# EAGLE schematic M_B_adapter_414 (EAGLE 9.6.2)
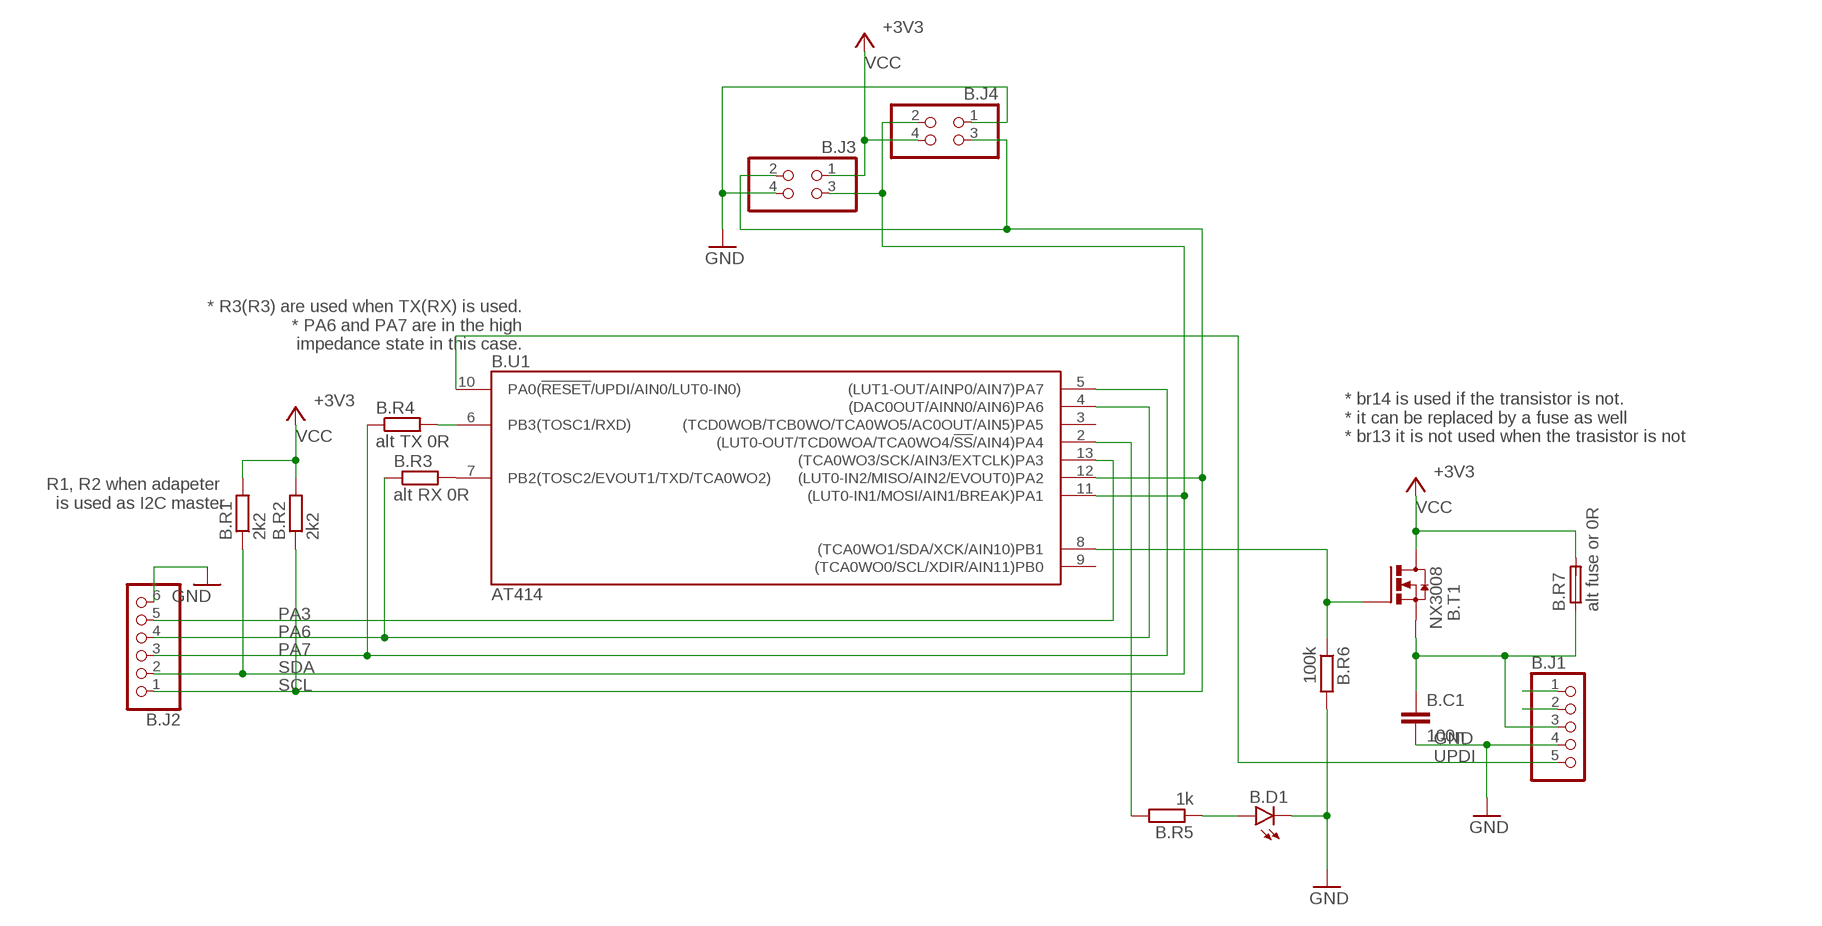
[diagram p0: schematic, sheet 1]

## Parts
B.C1  100n  C-EUC0603  [C0603]
B.D1  LEDCHIP-LED0603  [CHIP-LED0603]
B.J1  PINHD-1X5  [1X05]
B.J2  PINHD-1X6  [1X06]
B.J3  PINHD-2X2  [2X02]
B.J4  PINHD-2X2  [2X02]
B.R1  2k2  R-EU_R0603  [R0603]
B.R2  2k2  R-EU_R0603  [R0603]
B.R3  alt RX 0R  R-EU_R0603  [R0603]
B.R4  alt TX 0R  R-EU_R0603  [R0603]
B.R5  1k  R-EU_R0603  [R0603]
B.R6  100k  R-EU_R0603  [R0603]
B.R7  alt fuse or 0R  FUSE  [FUSE]
B.T1  NX3008  N-MOSFET  [SO23]
B.U1  AT414  ATTINY414-SSN  [SO14]

## Nets
GND: B.C1.2 B.D1.C1(C) B.J1.4 B.J2.6 B.J3.4 B.J4.1 B.R6.2
N$1: B.R4.2 B.U1.6(PB3(TOSC1/RXD))
N$2: B.R3.2 B.U1.7(PB2(TOSC2/EVOUT1/TXD/TCA0WO2))
N$3: B.R6.1 B.T1.G B.U1.8((TCA0WO1/SDA/XCK/AIN10)PB1)
N$4: B.C1.1 B.J1.3 B.R7.1 B.T1.S
N$5: B.R5.2 B.U1.2((LUT0-OUT/TCD0WOA/TCA0WO4/!SS!/AIN4)PA4)
PA1: B.D1.A1(A) B.R5.1
PA3: B.J2.5 B.U1.13((TCA0WO3/SCK/AIN3/EXTCLK)PA3)
PA6: B.J2.4 B.R3.1 B.U1.4((DAC0OUT/AINN0/AIN6)PA6)
PA7: B.J2.3 B.R4.1 B.U1.5((LUT1-OUT/AINP0/AIN7)PA7)
SCL: B.J2.1 B.J3.2 B.J4.3 B.R2.1 B.U1.12((LUT0-IN2/MISO/AIN2/EVOUT0)PA2)
SDA: B.J2.2 B.J3.3 B.J4.2 B.R1.1 B.U1.11((LUT0-IN1/MOSI/AIN1/BREAK)PA1)
UPDI: B.J1.5 B.U1.10(PA0(!RESET!/UPDI/AIN0/LUT0-IN0))
VBAT: B.J1.2
VCC: B.J3.1 B.J4.4 B.R1.2 B.R2.2 B.R7.2 B.T1.D ; supply symbol labelled +3V3
VUSB: B.J1.1
Unconnected: B.U1.3((TCD0WOB/TCB0WO/TCA0WO5/AC0OUT/AIN5)PA5) B.U1.9((TCA0WO0/SCL/XDIR/AIN11)PB0)

## Notes on the sheet
- * R3(R3) are used when TX(RX) is used. 
  * PA6 and PA7 are in the high 
    impedance state in this case.
- * br14 is used if the transistor is not. 
  * it can be replaced by a fuse as well
  * br13 it is not used when the trasistor is not
- R1, R2 when adapeter 
  is used as I2C master

## Power pins joined to a net without a drawn wire
GND: B.U1.14(GND)
VCC: B.U1.1(VCC)

## Library data of the parts
B.C1 = rcl:C-EU: CAPACITOR, European symbol; SPICEPREFIX: C
B.D1 = led:LED: LED OSRAM: - CHIPLED LG R971, LG N971, LY N971, LG Q971, LY Q971, LO R971, LY R971 LH N974, LH R974 LS Q976, LO Q976, LY Q976 LO Q996 - Hyper CHIPLED LW Q18S LB Q993, LB Q99A, LB R99A - SideLED LS A670, LO A670, LY A670, LG A670, LP A670 LB A673, LV A673, LT A673, LW A673 LH A674 LY A675 LS A676, LA A676, LO A676, LY A676, LW A676 LS A679, LY A679, LG A679 - Hyper Micro SIDELED® LS Y876, LA Y876, LO Y876, LY Y876 LT Y87S - SmartLED LW L88C, LW L88S LB L89C, LB L89S, LG L890 LS L89K, LO L89K, LY L89K LS L896, LA L896, LO L896, LY L896 - TOPLED LS T670, LO T670, LY T670, LG T670, LP T670 LSG T670, LSP T670, LSY T670, LOP T670, LYG T670 LG T671, LOG T671, LSG T671 LB T673, LV T673, LT T673, LW T673 LH T674 LS T676, LA T676, LO T676, LY T676, LB T676, LH T676, LSB T676, LW T676 LB T67C, LV T67C, LT T67C, LS T67K, LO T67K, LY T67K, LW E67C LS E67B, LA E67B, LO E67B, LY E67B, LB E67C, LV E67C, LT E67C LW T67C LS T679, LY T679, LG T679 LS T770, LO T770, LY T770, LG T770, LP T770 LB T773, LV T773, LT T773, LW T773 LH T774 LS E675, LA E675, LY E675, LS T675 LS T776, LA T776, LO T776, LY T776, LB T776 LHGB T686 LT T68C, LB T68C - Hyper Mini TOPLED® LB M676 - Mini TOPLED Santana® LG M470 LS M47K, LO M47K, LY M47K Source: http://www.osram.convergy.de LUXEON: - LUMILED® LXK2-PW12-R00, LXK2-PW12-S00, LXK2-PW14-U00, LXK2-PW14-V00 LXK2-PM12-R00, LXK2-PM12-S00, LXK2-PM14-U00 LXK2-PE12-Q00, LXK2-PE12-R00, LXK2-PE12-S00, LXK2-PE14-T00, LXK2-PE14-U00 LXK2-PB12-K00, LXK2-PB12-L00, LXK2-PB12-M00, LXK2-PB14-N00, LXK2-PB14-P00, LXK2-PB14-Q00 LXK2-PR12-L00, LXK2-PR12-M00, LXK2-PR14-Q00, LXK2-PR14-R00 LXK2-PD12-Q00, LXK2-PD12-R00, LXK2-PD12-S00 LXK2-PH12-R00, LXK2-PH12-S00 LXK2-PL12-P00, LXK2-PL12-Q00, LXK2-PL12-R00 Source: www.luxeon.com KINGBRIGHT: KA-3528ASYC Source: www.kingbright.com
B.J1 = pinhead2:PINHD-1X5: PIN HEADER
B.J2 = pinhead2:PINHD-1X6: PIN HEADER
B.J3 B.J4 = pinhead2:PINHD-2X2: PIN HEADER
B.R1-B.R6 = rcl:R-EU_: RESISTOR, European symbol; SPICEPREFIX: R
B.R7 = hugo:FUSE
B.T1 = hugo:N-MOSFET
B.U1 = atmel:ATTINY*14: 8-bit AVR tiny-1-series Microcontroller CPU: two-cycle hardware multiplier single pin Unified Program Debug Interface (UPDI) programmable watchdog timer with separate on-chip oscillator programmable brown-out detection circuit with software disable function internal calibrated oscillator Status aktiv aktiv aktiv aktiv ATtiny214 ATtiny414 ATtiny814 ATtiny1614 General purpose working registers 32 SRAM 128 B 256 B 512 B 2 kB Program flash memory 2 kB 4 kB 8 kB 16 kB EEPROM 64 B 128 B 128 B 256 B 16-bit Timer/Counter type A (TCA) 1 16-bit Timer/Counter type B (TCB) 1 2 12-bit Timer/Counter type D (TCD) 1 Real Time Counter (RTC) 1 USART 1 SPI 1 TWI (I2C) 1 ADC 1 2 ADC channels 10 10+4 ADC resolution 10 bit DAC 1 3 AC 1 3 Peripheral Touch Controller (PTC) - 1 PTC number of self-capacitance channels - 6 PTC number of mutual-capacitance channels - 9 Custom Configurable Logic/Lookup tables 1/2 Window Watchdog 1 Event System channels 6 General purpose I/O 12 External interrupts 12 CRCSCAN 1 Operating voltage 1.8 ... 5.5 V Speed grade 0 ... 5 MHz @ 1.8 ... 5.5 V 0 ... 10 MHz @ 2.7 ... 5.5 V 0 ... 20 MHz @ 4.5 ... 5.5 V Clock options internal 16/20 MHz low power RC oscillator internal 32.768 kHz ultra low power RC oscillator external 32.768 kHz low-frequency crystal oscillator external clock input Pin Name Other/Special ADC0 ADC1 PTC AC0 AC1 AC2 DAC0 USART0 SPI0 TWI0 TCA0 TCBn TCD0 CCL PA0 !RESET, UPDI AIN0 LUT0-IN0 PA1 AIN1 TxD MOSI SDA LUT0-IN1 PA2 EVOUT0 AIN2 RxD MISO SCL LUT0-IN2 PA3 EXTCLK AIN3 XCK SCK WO3 TCB1 WO PA4 AIN4 AIN0 X0/Y0 XDIR !SS WO4 WOA LUT0-OUT PA5 VREFA AIN5 AIN1 X1/Y1 OUT AINN0 WO5 TCB0 WO WOB PA6 AIN6 AIN2 X2/Y2 AINN0 AINP1 AINP0 OUT PA7 AIN7 AIN3 X3/Y3 AINP0 AINP0 AINN0 LUT1-OUT PB3 TOSC1 OUT RxD WO0 PB2 TOSC2, EVOUT1 OUT TxD WO2 PB1 AIN10 X4/Y4 AINP2 XCK SDA WO1 PB0 AIN11 X5/Y5 AINP2 AINP1 XDIR SCL WO0 only available in devices with 8/16KByte flash, X- or Y-line only available in device ATtiny1614